# Altium schematic sheet STM32F103VBT6-design.SchDoc
size A4
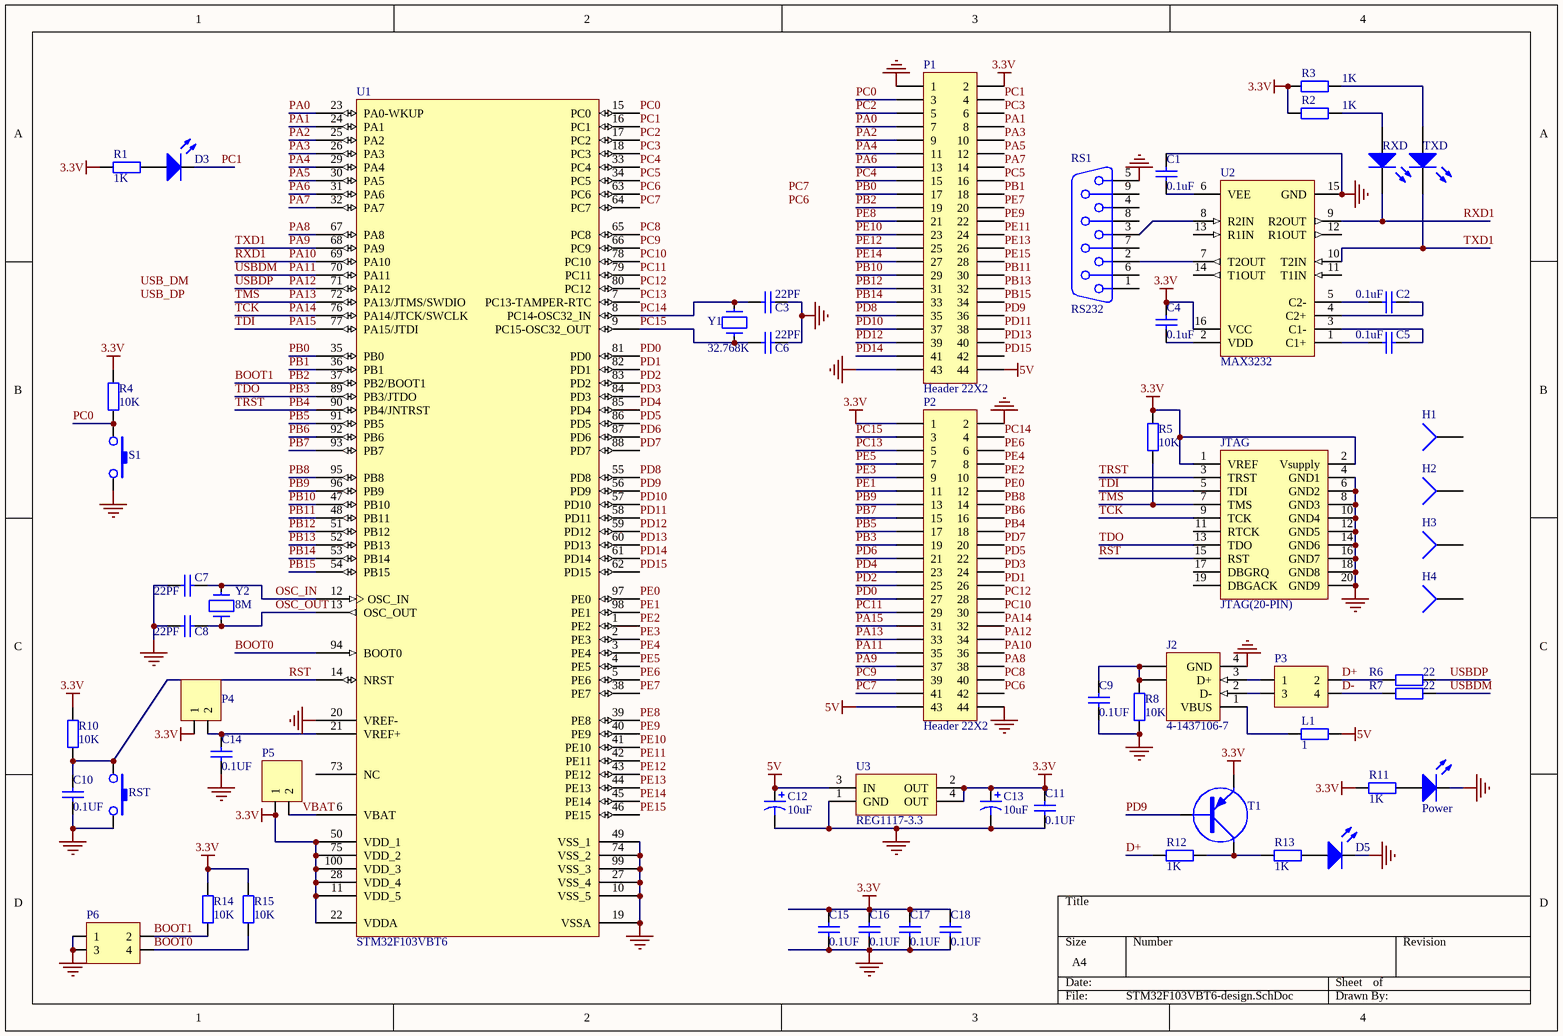
[diagram p0: STM32F103VBT6-design.SchDoc]

## Parts
C1  value 0.1uF  [0805-S]  (hidden comment: Cap)
C2  value 0.1uF  [0805-S]  (hidden comment: Cap)
C3  value 22PF  [0805-S]  (hidden comment: Cap)
C4  value 0.1uF  [0805-S]  (hidden comment: Cap)
C5  value 0.1uF  [0805-S]  (hidden comment: Cap)
C6  value 22PF  [0805-S]  (hidden comment: Cap)
C7  value 22PF  [0805-S]  (hidden comment: Cap)
C8  value 22PF  [0805-S]  (hidden comment: Cap)
C9  value 0.1UF  [0805-S]  (hidden comment: Cap)
C10  value 0.1UF  [0805-S]  (hidden comment: Cap)
C11  value 0.1UF  [0805-S]  (hidden comment: Cap)
C12  value 10uF  [C_10UF]  (hidden comment: Cap Pol1)
C13  value 10uF  [C_10UF]  (hidden comment: Cap Pol1)
C14  value 0.1UF  [0805-S]  (hidden comment: Cap)
C15  value 0.1UF  [0805-S]  (hidden comment: Cap)
C16  value 0.1UF  [0805-S]  (hidden comment: Cap)
C17  value 0.1UF  [0805-S]  (hidden comment: Cap)
C18  value 0.1UF  [0805-S]  (hidden comment: Cap)
D3  LED1  [C0805]  (value not drawn)
D5  LED1  [C0805]  (value not drawn)
H1  Socket  [Hold_2]  (value not drawn)
H2  Socket  [Hold_2]  (value not drawn)
H3  Socket  [Hold_2]  (value not drawn)
H4  Socket  [Hold_2]  (value not drawn)
J2  4-1437106-7  [USB_B_LOGO]
JTAG  JTAG(20-PIN)  [IDE20-DIP]
L1  value 1  [0805-S]  (hidden comment: Res2)
P1  Header 22X2  [HDR2X22]
P2  Header 22X2  [HDR2X22]
P3  Header 2X2  [HDR2X2]  (value not drawn)
P4  Header 2  [HDR1X2]  (value not drawn)
P5  Header 2  [HDR1X2]  (value not drawn)
P6  Header 2X2  [HDR2X2]  (value not drawn)
Power  LED1  [C0805]  (value not drawn)
R1  value 1K  [0805-S]  (hidden comment: Res2)
R2  value 1K  [0805-S]  (hidden comment: Res2)
R3  value 1K  [0805-S]  (hidden comment: Res2)
R4  value 10K  [0805-S]  (hidden comment: Res2)
R5  value 10K  [0805-S]  (hidden comment: Res2)
R6  value 22  [0805-S]  (hidden comment: Res2)
R7  value 22  [0805-S]  (hidden comment: Res2)
R8  value 10K  [0805-S]  (hidden comment: Res2)
R10  value 10K  [0805-S]  (hidden comment: Res2)
R11  value 1K  [0805-S]  (hidden comment: Res2)
R12  value 1K  [0805-S]  (hidden comment: Res2)
R13  value 1K  [0805-S]  (hidden comment: Res2)
R14  value 10K  [0805-S]  (hidden comment: Res2)
R15  value 10K  [0805-S]  (hidden comment: Res2)
RS1  RS232  [DSUB1.385-2H9]
RST  SW-PB  [key-press]  (value not drawn)
RXD  LED0  [C0805]  (value not drawn)
S1  SW-PB  [key-press]  (value not drawn)
T1  8550  [BEC-123]  (value not drawn)
TXD  LED0  [C0805]  (value not drawn)
U1  STM32F103VBT6  [LQFP100_N]
U2  MAX3232  [SOIC16]
U3  REG1117-3.3  [ZZ311]
Y1  32.768K  [32768K]
Y2  8M  [XTAL_DIP]

## Nets
3.3V: C4.2 C11.1 C13.1 C15.1 C16.1 C17.1 C18.1 JTAG.1(VREF) JTAG.2(Vsupply) P1.2 P2.1 P4.1 P5.1 R1.2 R2.1 R3.1 R4.2 R5.1 R10.2 R11.2 R14.2 R15.2 T1.2(E) U1.11(VDD_5) U1.22(VDDA) U1.28(VDD_4) U1.50(VDD_1) U1.75(VDD_2) U1.100(VDD_3) U2.16(VCC) U3.2(OUT) U3.4(OUT)
5V: C12.1 L1.2 P1.44 P2.43 U3.3(IN)
GND: C1.2 C3.2 C6.2 C7.2 C8.2 C9.2 C10.2 C11.2 C12.2 C13.2 C14.2 C15.2 C16.2 C17.2 C18.2 D5.2(K) J2.4(GND) JTAG.4(GND1) JTAG.6(GND2) JTAG.8(GND3) JTAG.10(GND4) JTAG.12(GND5) JTAG.14(GND6) JTAG.16(GND7) JTAG.18(GND8) JTAG.20(GND9) P1.1 P1.43 P2.2 P2.44 P6.1 P6.3 Power.2(K) R8.1 RS1.5 RST.2 S1.2 U1.10(VSS_5) U1.19(VSSA) U1.20(VREF-) U1.27(VSS_4) U1.49(VSS_1) U1.74(VSS_2) U1.99(VSS_3) U2.15(GND) U3.1(GND)
BOOT0: P6.4 R15.1 U1.94(BOOT0)
BOOT1: P1.19 P6.2 R14.1 U1.37(PB2/BOOT1)  [also labelled PB2]
D+: P3.2 R6.2 R12.2
D-: P3.4 R7.2
OSC_IN: C7.1 U1.12(OSC_IN) Y2.2
OSC_OUT: C8.1 U1.13(OSC_OUT) Y2.1
PA0: P1.7 U1.23(PA0-WKUP)
PA1: P1.8 U1.24(PA1)
PA2: P1.9 U1.25(PA2)
PA3: P1.10 U1.26(PA3)
PA4: P1.11 U1.29(PA4)
PA5: P1.12 U1.30(PA5)
PA6: P1.13 U1.31(PA6)
PA7: P1.14 U1.32(PA7)
PA8: P2.38 U1.67(PA8)
PA9: P2.37 TXD.2(K) U1.68(PA9) U2.10(T2IN)  [also labelled TXD1]
PA10: P2.36 RXD.2(K) U1.69(PA10) U2.9(R2OUT)  [also labelled RXD1]
PA11: P2.35 R7.1 U1.70(PA11)  [also labelled USBDM]
PA12: P2.34 R6.1 U1.71(PA12)  [also labelled USBDP]
PA13: JTAG.7(TMS) P2.33 R5.2 U1.72(PA13/JTMS/SWDIO)  [also labelled TMS]
PA14: JTAG.9(TCK) P2.32 U1.76(PA14/JTCK/SWCLK)  [also labelled TCK]
PA15: JTAG.5(TDI) P2.31 U1.77(PA15/JTDI)  [also labelled TDI]
PB0: P1.17 U1.35(PB0)
PB1: P1.18 U1.36(PB1)
PB3: JTAG.13(TDO) P2.19 U1.89(PB3/JTDO)  [also labelled TDO]
PB4: JTAG.3(TRST) P2.18 U1.90(PB4/JNTRST)  [also labelled TRST]
PB5: P2.17 U1.91(PB5)
PB6: P2.16 U1.92(PB6)
PB7: P2.15 U1.93(PB7)
PB8: P2.14 U1.95(PB8)
PB9: P2.13 U1.96(PB9)
PB10: P1.29 U1.47(PB10)
PB11: P1.30 U1.48(PB11)
PB12: P1.31 U1.51(PB12)
PB13: P1.32 U1.52(PB13)
PB14: P1.33 U1.53(PB14)
PB15: P1.34 U1.54(PB15)
PC0: P1.3 R4.1 S1.1 U1.15(PC0)
PC1: D3.2(K) P1.4 U1.16(PC1)
PC2: P1.5 U1.17(PC2)
PC3: P1.6 U1.18(PC3)
PC4: P1.15 U1.33(PC4)
PC5: P1.16 U1.34(PC5)
PC6: P2.42 U1.63(PC6)
PC7: P2.41 U1.64(PC7)
PC8: P2.40 U1.65(PC8)
PC9: P2.39 U1.66(PC9)
PC10: P2.30 U1.78(PC10)
PC11: P2.29 U1.79(PC11)
PC12: P2.28 U1.80(PC12)
PC13: P2.5 U1.7(PC13-TAMPER-RTC)
PC14: C3.1 P2.4 U1.8(PC14-OSC32_IN) Y1.1
PC15: C6.1 P2.3 U1.9(PC15-OSC32_OUT) Y1.2
PD0: P2.27 U1.81(PD0)
PD1: P2.26 U1.82(PD1)
PD2: P2.25 U1.83(PD2)
PD3: P2.24 U1.84(PD3)
PD4: P2.23 U1.85(PD4)
PD5: P2.22 U1.86(PD5)
PD6: P2.21 U1.87(PD6)
PD7: P2.20 U1.88(PD7)
PD8: P1.35 U1.55(PD8)
PD9: P1.36 T1.1(B) U1.56(PD9)
PD10: P1.37 U1.57(PD10)
PD11: P1.38 U1.58(PD11)
PD12: P1.39 U1.59(PD12)
PD13: P1.40 U1.60(PD13)
PD14: P1.41 U1.61(PD14)
PD15: P1.42 U1.62(PD15)
PE0: P2.12 U1.97(PE0)
PE1: P2.11 U1.98(PE1)
PE2: P2.10 U1.1(PE2)
PE3: P2.9 U1.2(PE3)
PE4: P2.8 U1.3(PE4)
PE5: P2.7 U1.4(PE5)
PE6: P2.6 U1.5(PE6)
PE7: P1.20 U1.38(PE7)
PE8: P1.21 U1.39(PE8)
PE9: P1.22 U1.40(PE9)
PE10: P1.23 U1.41(PE10)
PE11: P1.24 U1.42(PE11)
PE12: P1.25 U1.43(PE12)
PE13: P1.26 U1.44(PE13)
PE14: P1.27 U1.45(PE14)
PE15: P1.28 U1.46(PE15)
RST: C10.1 JTAG.15(RST) R10.1 RST.1 U1.14(NRST)
VBAT: P5.2 U1.6(VBAT)
NetC1_1: C1.1 U2.6(VEE)
NetC2_1: C2.1 U2.5(C2-)
NetC2_2: C2.2 U2.4(C2+)
NetC4_1: C4.1 U2.2(VDD)
NetC5_1: C5.1 U2.1(C1+)
NetC5_2: C5.2 U2.3(C1-)
NetC9_1: C9.1 J2.5(SHLD) J2.6(SHLD) R8.2
NetC14_1: C14.1 P4.2 U1.21(VREF+)
NetD3_1: D3.1(A) R1.1
NetD5_1: D5.1(A) R13.1
NetJ2_1: J2.1(VBUS) L1.1
NetJ2_2: J2.2(D-) P3.3
NetJ2_3: J2.3(D+) P3.1
NetPower_1: Power.1(A) R11.1
NetR2_2: R2.2 RXD.1(A)
NetR3_2: R3.2 TXD.1(A)
NetR12_1: R12.1 R13.2 T1.3(C)
NetRS1_2: RS1.2 U2.7(T2OUT)
NetRS1_3: RS1.3 U2.8(R2IN)

Not connected (* = marked no-connect by the designer): H1 1; H2 1; H3 1; H4 1; JTAG 11(RTCK) 17(DBGRQ) 19(DBGACK); RS1 1 4 6 7 8 9; U1 73(NC); U2 11(T1IN) 12(R1OUT) 13(R1IN) 14(T1OUT)

## Notes on the sheet
- Labels drawn without touching a wire or pin: PC6, PC7, USB_DM, USB_DP

## Library data of the parts
C1-C11 C14-C18 = Cap: Capacitor; Published: 8-Jun-2000; LatestRevisionDate: 17-Jul-2002; LatestRevisionNote: Re-released for DXP Platform.; PackageReference: RAD-0.3; Publisher: Altium Limited
C12 C13 = Cap Pol1: Polarized Capacitor (Radial); Published: 8-Jun-2000; LatestRevisionDate: 17-Jul-2002; LatestRevisionNote: Re-released for DXP Platform.; PackageReference: RB7.6-15; Publisher: Altium Limited
D3 D5 Power RXD TXD = LED0: Typical INFRARED GaAs LED; Published: 8-Jun-2000; Publisher: Altium Limited
  D3 D5 Power: LatestRevisionDate: 17-Jul-2002; LatestRevisionNote: Re-released for DXP Platform.
  RXD TXD: LatestRevisionDate: 08-Jul-2005; LatestRevisionNote: Mech Layer 1 removed.; PackageReference: LED-0
J2 = 4-1437106-7: USB 1.1, Right Angle, Thru-Hole, B Type, Receptacle, 4 Position, White; ContactMaterial: Copper Alloy; ContactPlating: Gold (30); TerminationLength: 2.90mm [0.114in.]; PCB_Layout: Complies with manufacturer's recommendation.; DrillSize: Corresponds to nominal value.; PanelGround: Without; Published: 15-Jul-2004; DatasheetDocument: 05-Jan-2004; PackageDocument: 05-Jan-2004; PackageReference: 1437106; Publisher: Altium Limited; HousingMaterial: Glass-Filled Thermoplastic; ComponentLink1Description: Manufacturer Link; ComponentLink1URL: http://www.tycoelectronics.com/; ComponentLink2Description: Packaging Specification; ComponentLink2URL: http://ecommas.tycoelectronics.com/commerce/DocumentDelivery/DDEController?Action=showdoc&DocId=Customer+Drawing%7F1437106%7FC%7Ftif%7FEnglish%7FENG_CD_1437106_C.tif
JTAG = JTAG20
L1 R1-R8 R10-R15 = Res2: Resistor; Published: 8-Jun-2000; LatestRevisionDate: 17-Jul-2002; LatestRevisionNote: Re-released for DXP Platform.; PackageReference: AXIAL-0.4; Publisher: Altium Limited
P1 P2 = Header 22X2: Header, 22-Pin, Dual row; LatestRevisionDate: 17-Jul-2002; LatestRevisionNote: Re-released for DXP Platform.; Publisher: Altium Limited
P3 P6 = Header 2X2: Header, 2-Pin, Dual row; LatestRevisionDate: 17-Jul-2002; LatestRevisionNote: Re-released for DXP Platform.; Publisher: Altium Limited
P4 P5 = Header 2: Header, 2-Pin; LatestRevisionDate: 17-Jul-2002; LatestRevisionNote: Re-released for DXP Platform.; Publisher: Altium Limited
RS1 = DB9
T1 = PNP: PNP Transistor
U1 = STM32F103VBT6: STM32 ARM-based 32-bit MCU with 64 Kbytes Flash, 100-pin LQFP, Industrial Temperature; Published: 30-May-2008; DatasheetVersion: rev6, Mar-2008; PackageVersion: Mar-2008; PackageReference: LQFP100; Publisher: Altium Limited; PackageDescription: 100-Pin Low-Profile Quad Flat Pack, 14 x 14 mm Body, 0.5 mm Pitch (LQFP100); ComponentLink1Description: Manufacturer Link; ComponentLink1URL: www.st.com/stm32; ComponentLink2Description: Datasheet; ComponentLink2URL: http://www.st.com/stonline/products/literature/ds/13587.pdf
U2 = MAX232ACWE: +5V Powered, Multi-Channel RS-232 Driver/Receiver; Published: 16-Jan-2001; LatestRevisionDate: 13-Apr-2006; LatestRevisionNote: IPC-7351 Footprint Added.; PackageReference: WSO16; Publisher: Altium Limited; PackageDescription: 16-Pin Small Outline Integrated Circuit 1.27 mm Pitch; Code_JEDEC: MS-013-AA; Code_IPC: SOIC127P1030-16; ComponentLink1Description: Manufacturer Link; ComponentLink1URL: http://www.maxim-ic.com/; ComponentLink2Description: Datasheet; ComponentLink2URL: http://pdfserv.maxim-ic.com/en/ds/MAX220-MAX249.pdf
U3 = REG1117-3.3: 800mA and 1A Low Dropout Positive Regulator 2.85V, 3.3V, 5V, and Adjustable; Published: 8-Jun-2000; LatestRevisionDate: 17-Jul-2002; LatestRevisionNote: Re-released for DXP Platform.; DatasheetVersion: Sep-1997; PackageVersion: revC; PackageReference: ZZ311; Publisher: Altium Limited; PackageDescription: SOT-223/SC-73; 4 Leads; Body 6.7 x 7.3 mm, inc. leads (LxW max); ComponentLink1Description: Manufacturer Link; ComponentLink1URL: http://www.ti.com/; ComponentLink2Description: Datasheet; ComponentLink2URL: http://www-s.ti.com/sc/ds/REG1117.pdf
Y1 Y2 = CRYSTAL
H1-H4 = Socket: LatestRevisionDate: 17-Jul-2002; LatestRevisionNote: Re-released for DXP Platform.; Publisher: Altium Limited